# EAGLE design BMP085 Breakout-v10 (EAGLE 5.11)
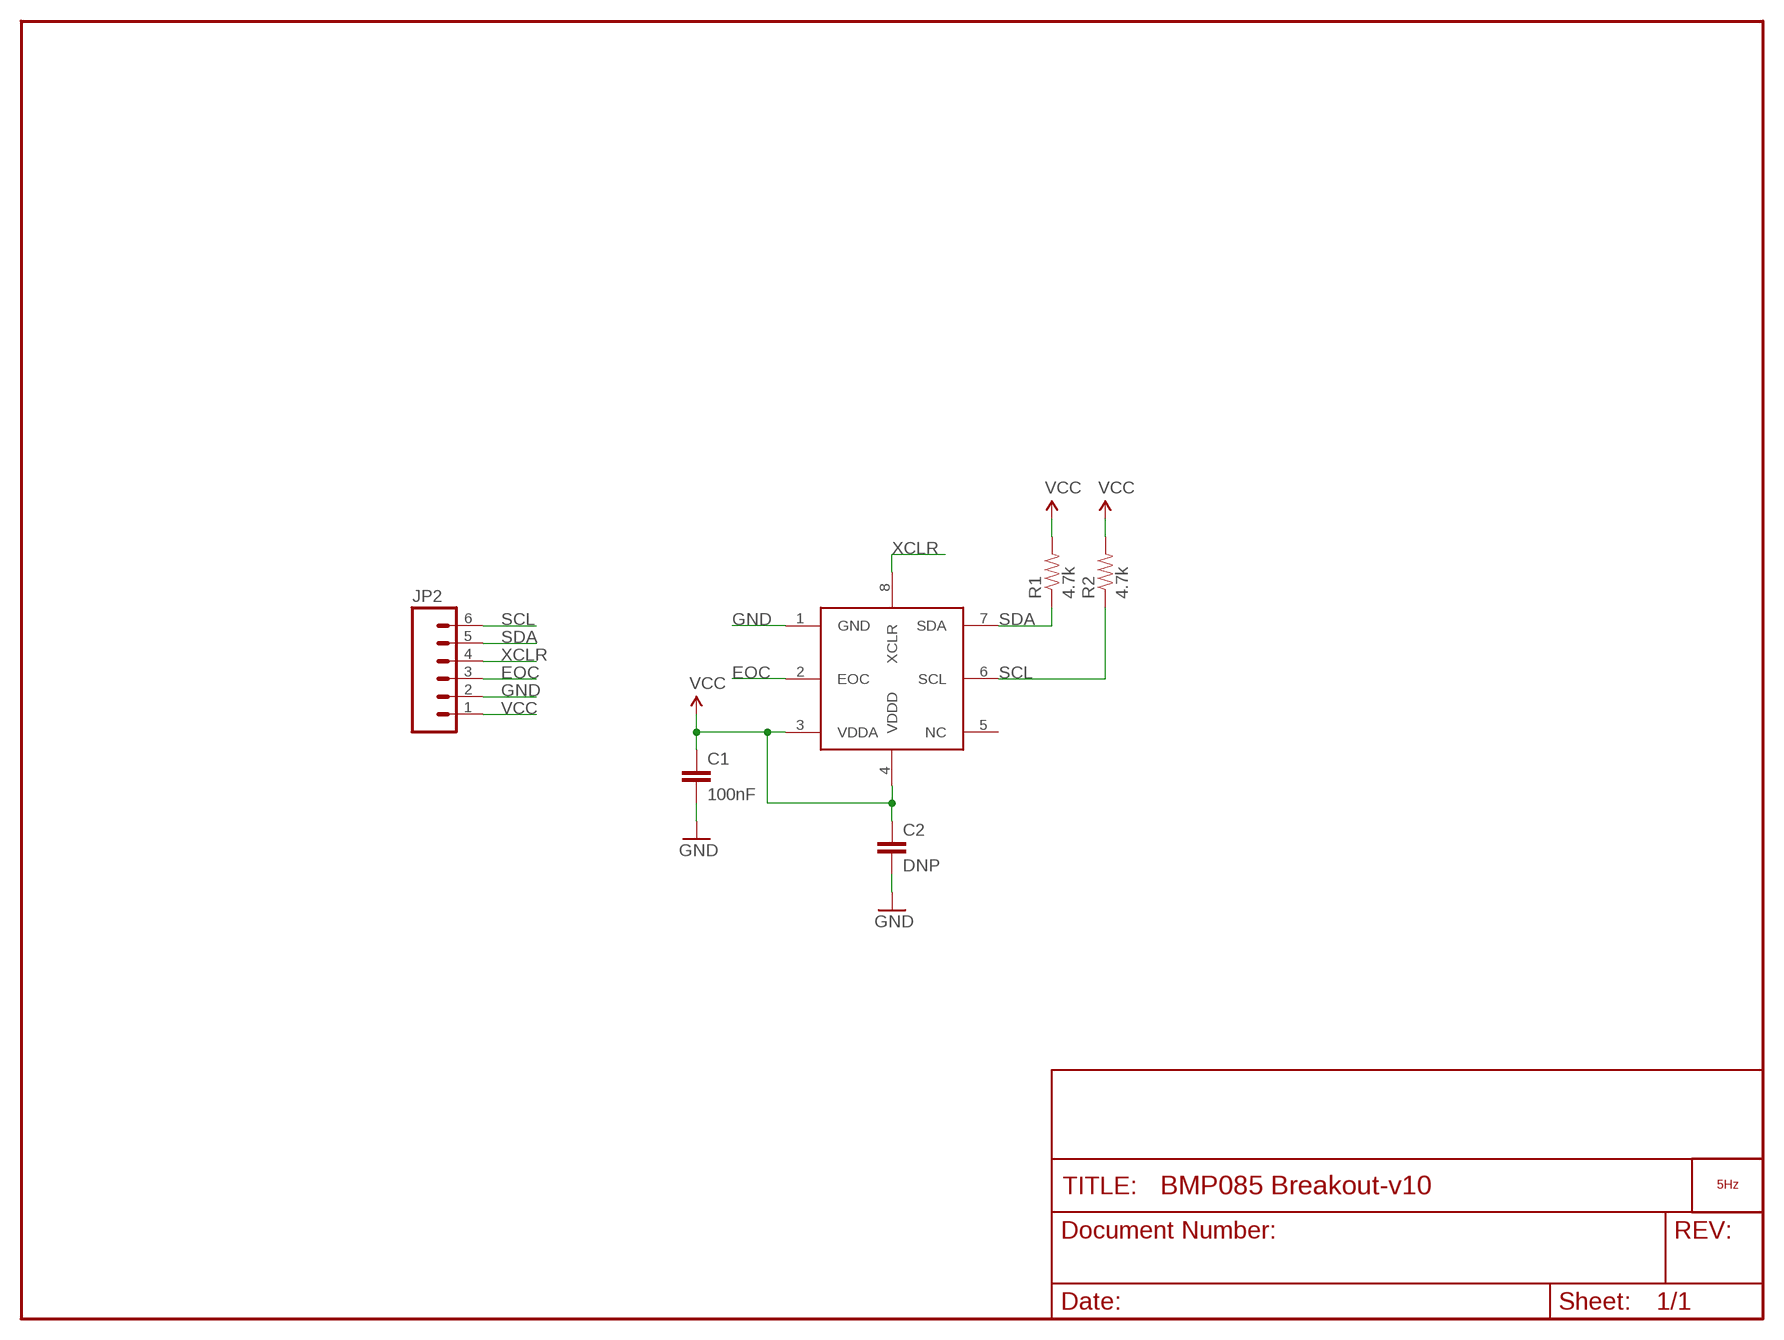
[diagram p0: schematic, sheet 1]

## Parts
C1  100nF  CAP0603-CAP  [0603-CAP]
C2  DNP  CAP0603-CAP  [0603-CAP]
JP2  M06SIP  [1X06]
LOGO1  LOGO_5HZ_CIRC_COOPER_5MM  [5HZ_LOGO_CIRC_COOPER_5MM]
R1  4.7k  RESISTORPTH-1/6W  [1/6W-RES]
R2  4.7k  RESISTORPTH-1/6W  [1/6W-RES]
U$1  BMP085  [BMP085]

## Nets
EOC: JP2.3 U$1.2(EOC)
GND: C1.2 C2.2 JP2.2 U$1.1(GND)
SCL: JP2.6 R2.1 U$1.6(SCL)
SDA: JP2.5 R1.1 U$1.7(SDA)
VCC: C1.1 C2.1 JP2.1 R1.2 R2.2 U$1.3(VDDA) U$1.4(VDDD)
XCLR: JP2.4 U$1.8(XCLR)
Unconnected: U$1.5(NC)

## Library data of the parts
C1 C2 = SparkFun:CAP: Capacitor Standard 0603 ceramic capacitor, and 0.1" leaded capacitor.
JP2 = SparkFun:M06: Header 6 Standard 6-pin 0.1" header. Use with straight break away headers (SKU : PRT-00116), right angle break away headers (PRT-00553), swiss pins (PRT-00743), machine pins (PRT-00117), and female headers (PRT-00115). Molex polarized connector foot print use with SKU : PRT-08094 with associated crimp pins and housings. NOTES ON THE VARIANTS LOCK and LOCK_LONGPADS... This footprint was designed to help hold the alignment of a through-hole component (i.e. 6-pin header) while soldering it into place. You may notice that each hole has been shifted either up or down by 0.005 of an inch from it's more standard position (which is a perfectly straight line). This slight alteration caused the pins (the squares in the middle) to touch the edges of the holes. Because they are alternating, it causes a "brace" to hold the component in place. 0.005 has proven to be the perfect amount of "off-center" position when using our standard breakaway headers. Although looks a little odd when you look at the bare footprint, once you have a header in there, the alteration is very hard to notice. Also, if you push a header all the way into place, it is covered up entirely on the bottom side. This idea of altering the position of holes to aid alignment will be further integrated into the Sparkfun Library for other footprints. It can help hold any component with 3 or more connection pins.
LOGO1 = 5hz-electronica:LOGO_5HZ: Logotipo 5Hz "según Pedro"
R1 R2 = SparkFun:RESISTOR: Resistor Basic schematic elements and footprints for 0603, 1206, and PTH 1/10th watt (small) resistors.
U$1 = SparkFun:BMP085

## Board
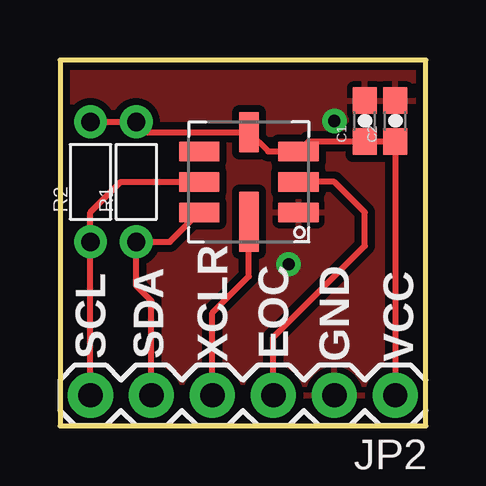
[diagram p1: board, top side]
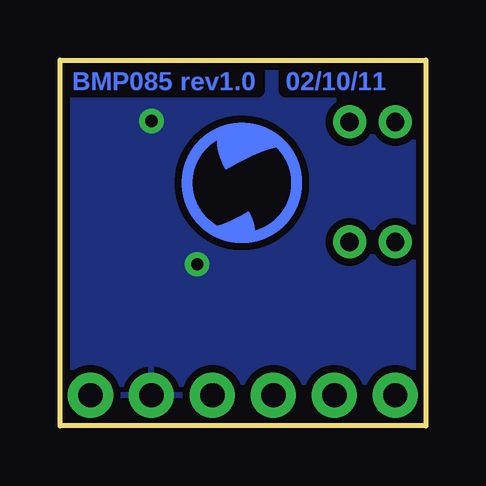
[diagram p2: board, bottom side, seen from below]

Size 15.24 x 15.24 mm. Coordinates in mm from the lower left corner, seen from the top.
Outline: 15.24,15.24 0,15.24 0,0 15.24,0 15.24,15.24
Copper layers (1*16): Top 0.035mm / dielectric 1.5mm / Bottom 0.035mm
Design rules "SparkFun": minimum track width 8mil, minimum drill 20mil, track to track 8mil, track to pad 8mil, pad to pad 8mil, via to via 8mil, smd to smd 8mil, copper to edge 9mil, drill to drill 8mil, minimum pad ring 12mil, minimum via ring 10mil, stop-mask expansion 4mil, vias tented up to drill 20mil, thermal gap 10mil

### Footprints (pad centres in the part's own frame; a part is rotated, then mirrored left to right if it is on the bottom)
0603-CAP = smd 1.1 x 1: 1 -0.85,0; 2 0.85,0
1X06 = drill 1.016 pad 1.88 round: 1 0,0; 2 2.54,0; 3 5.08,0; 4 7.62,0; 5 10.16,0; 6 12.7,0
1/6W-RES = drill 0.762 round: 1 -2.5,0; 2 2.5,0
BMP085 = smd 1.67 x 0.8: 1 -2.065,1.27; 2 -2.065,0; 3 -2.065,-1.27; 5 2.065,-1.27; 6 2.065,0; 7 2.065,1.27 | smd 0.8 x 1.67: 4 0,-2.065 | smd 0.8 x 2.5: 8 0,1.65

### Placement (x,y rotation side)
C1  12.7,12.7 90 top
C2  13.97,12.7 90 top
JP2  13.97,1.27 180 top
LOGO1  10.16,7.62 0 bottom
R1  3.17,10.16 90 top
R2  1.27,10.16 90 top
U$1  7.87,10.16 180 top

### Tracks (layer width: path | path; a pad name or v marks a point on that pad's centre or on a via)
EOC
  Top 0.254: JP2.3 8.89,3.68 12.7,7.49 12.7,8.89 11.43,10.16 U$1.2
GND  (via drill 0.51)
  other vias: 9.53,6.73 11.43,12.7
  pour Top (isolate 0.305): 15.24,0 15.24,15.24 0,15.24 0,0
  pour Bottom (isolate 0.305): 15.24,0 15.24,15.24 0,15.24 0,0
SCL
  Top 0.254: JP2.6 R2.1 1.27,8.89 2.54,10.16 U$1.6
SDA
  Top 0.254: JP2.5 3.81,5.21 3.17,5.84 R1.1 4.58,7.66 U$1.7
VCC
  Top 0.254: JP2.1 C2.1 C1.1 10.36,11.85 U$1.3 8.67,11.43 U$1.4 3.61,12.22 R1.2 R2.2
XCLR
  Top 0.254: JP2.4 6.35,4.7 7.87,6.22 U$1.8

### Text on the board
Bottom: 02/10/11 | BMP085 rev1.0
tPlace: SCL | SDA | XCLR | EOC | GND | VCC